# EAGLE design 4x7-segments Arduino shield (EAGLE 9.3.2)

## Sheet 1 of 3
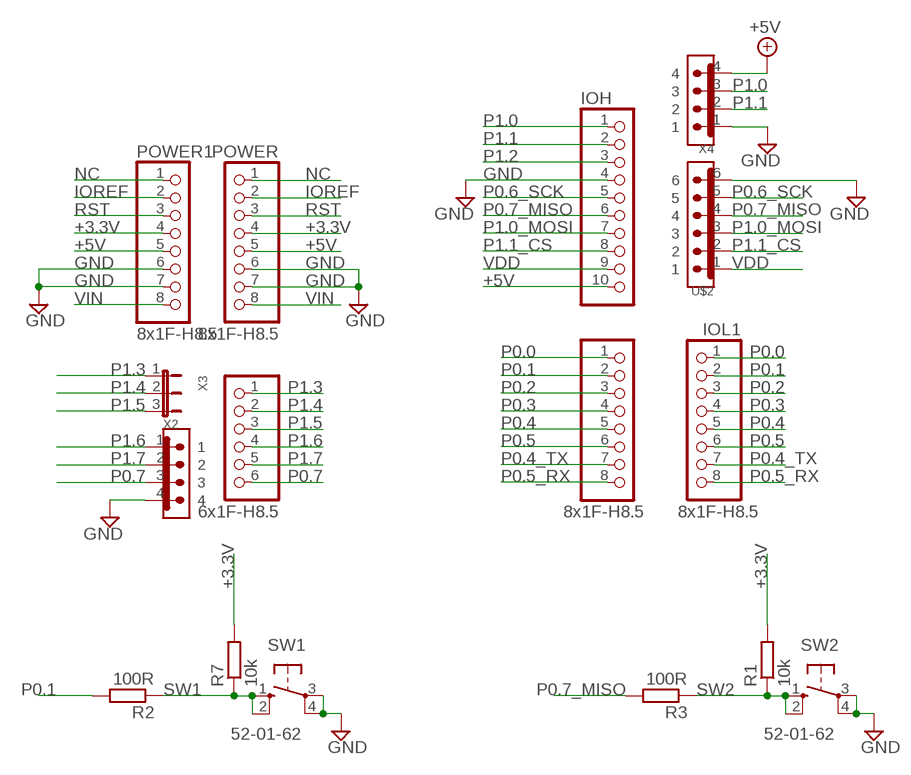
[diagram p0: schematic, sheet 1]

### Parts
AD  6x1F-H8.5  PINHD-1X6  [1X06]
IOH  10x1F-H8.5  PINHD-1X10_ARD  [1X10]
IOL  8x1F-H8.5  PINHD-1X8  [1X08]
IOL1  8x1F-H8.5  PINHD-1X8  [1X08]
POWER  8x1F-H8.5  PINHD-1X8  [1X08]
POWER1  8x1F-H8.5  PINHD-1X8  [1X08]
R1  10k  R0805  [R0805]
R2  100R  R0805  [R0805]
R3  100R  R0805  [R0805]
R7  10k  R0805  [R0805]
SW1  52-01-62  10-XX  [B3F-10XX]
SW2  52-01-62  10-XX  [B3F-10XX]
U$2  MOLEX6  [MOLEXV6]
X2  MOLEX4V  [MOLEXV4]
X3  JP2E  [JP2]
X4  MOLEX4V  [MOLEXV4]

### Nets
+3.3V: POWER1.4 POWER.4 R1.2 R7.2 ; also sheet 3
+5V: IOH.10 POWER1.5 POWER.5 X4.4 ; also sheet 2,3
GND: IOH.4 POWER1.6 POWER1.7 POWER.6 POWER.7 SW1.3(P) SW1.4(P1) SW2.3(P) SW2.4(P1) U$2.6 X2.4 X4.1 ; also sheet 2,3
IOREF: POWER1.2 POWER.2
NC: POWER1.1 POWER.1
P0.0: IOL1.1 IOL.1 ; also sheet 2
P0.1: IOL1.2 IOL.2 R2.2
P0.2: IOL1.3 IOL.3 ; also sheet 2
P0.3: IOL1.4 IOL.4 ; also sheet 2
P0.4: IOL1.5 IOL.5 ; also sheet 2
P0.4_TX: IOL1.7 IOL.7
P0.5: IOL1.6 IOL.6
P0.5_RX: IOL1.8 IOL.8
P0.6_SCK: IOH.5 U$2.5
P0.7: AD.6 X2.3
P0.7_MISO: IOH.6 R3.2 U$2.4
P1.0: IOH.1 X4.3
P1.0_MOSI: IOH.7 U$2.3
P1.1: IOH.2 X4.2 ; also sheet 2
P1.1_CS: IOH.8 U$2.2
P1.2: IOH.3 ; also sheet 2
P1.3: AD.1 X3.1
P1.4: AD.2 X3.2
P1.5: AD.3 X3.3 ; also sheet 3
P1.6: AD.4 X2.1
P1.7: AD.5 X2.2 ; also sheet 3
RST: POWER1.3 POWER.3
SW1: R2.1 R7.1 SW1.1(S) SW1.2(S1)
SW2: R1.1 R3.1 SW2.1(S) SW2.2(S1)
VDD: IOH.9 U$2.1
VIN: POWER1.8 POWER.8

## Sheet 2 of 3
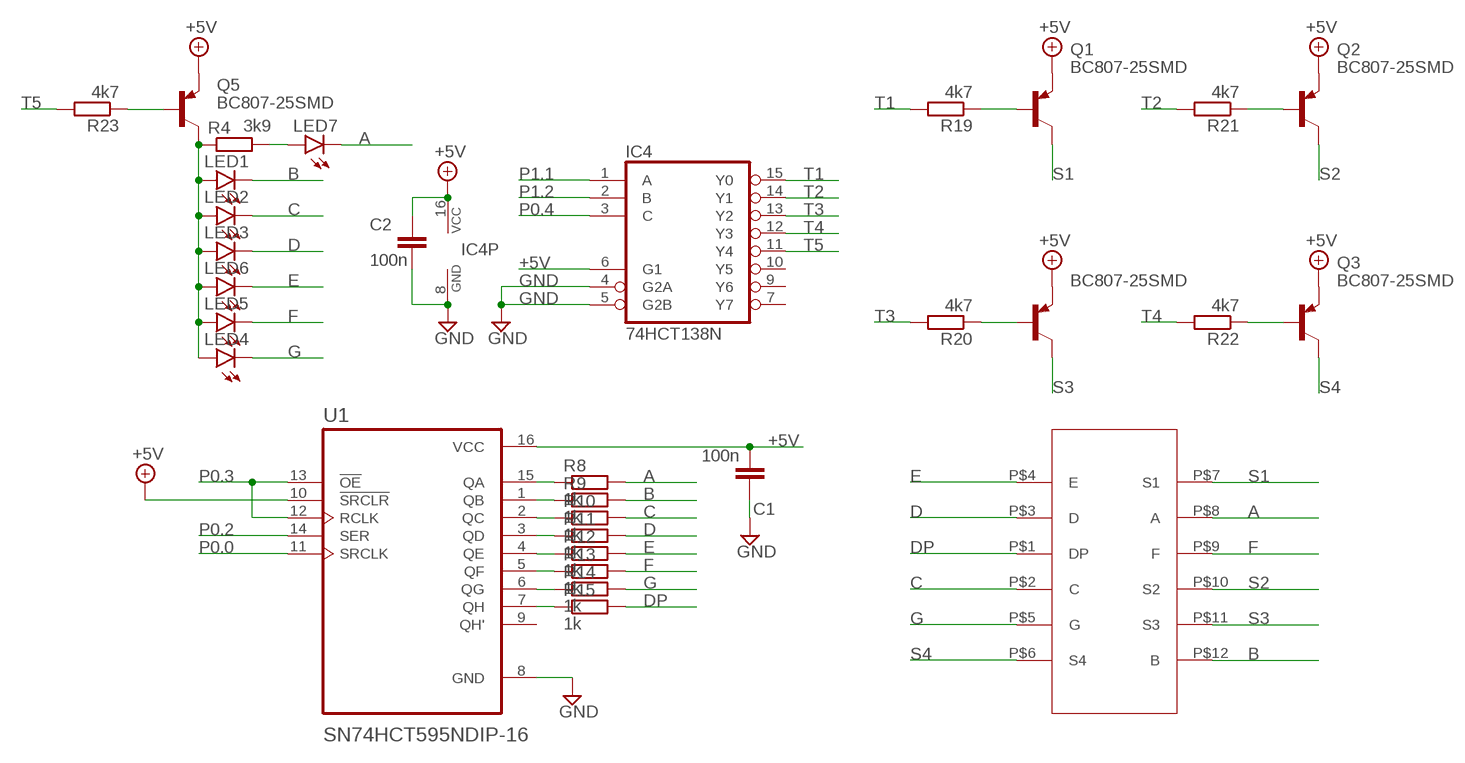
[diagram p1: schematic, sheet 2]

### Parts
C1  100n  C0805  [C0805]
C2  100n  C0805  [C0805]
IC4  74HCT138N  74HC138N  [DIL16]
LED1  LEDCHIPLED_1206  [CHIPLED_1206]
LED2  LEDCHIPLED_1206  [CHIPLED_1206]
LED3  LEDCHIPLED_1206  [CHIPLED_1206]
LED4  LEDCHIPLED_1206  [CHIPLED_1206]
LED5  LEDCHIPLED_1206  [CHIPLED_1206]
LED6  LEDCHIPLED_1206  [CHIPLED_1206]
LED7  LEDCHIPLED_1206  [CHIPLED_1206]
Q1  BC807-25SMD  [SOT23-BEC]
Q2  BC807-25SMD  [SOT23-BEC]
Q3  BC807-25SMD  [SOT23-BEC]
Q4  BC807-25SMD  [SOT23-BEC]
Q5  BC807-25SMD  [SOT23-BEC]
R4  3k9  R1206  [R1206]
R8  1k  R1206  [R1206]
R9  1k  R1206  [R1206]
R10  1k  R1206  [R1206]
R11  1k  R1206  [R1206]
R12  1k  R1206  [R1206]
R13  1k  R1206  [R1206]
R14  1k  R1206  [R1206]
R15  1k  R1206  [R1206]
R19  4k7  R0805  [R0805]
R20  4k7  R0805  [R0805]
R21  4k7  R0805  [R0805]
R22  4k7  R0805  [R0805]
R23  4k7  R0805  [R0805]
U1  SN74HCT595NDIP-16  SN74HC595NDIP-16  [DIP794W45P254L1969H508Q16]
U$1  SH5461AS  [SH5461AS]

### Nets
+5V: C1.1 C2.2 IC4.6(G1) IC4.16(VCC) Q1.E Q2.E Q3.E Q4.E Q5.E U1.10(!SRCLR) U1.16(VCC) ; also sheet 1,3
A: LED7.C R8.2 U$1.P$8(A)
B: LED1.C R9.2 U$1.P$12(B)
C: LED2.C R10.2 U$1.P$2(C)
D: LED3.C R11.2 U$1.P$3(D)
DP: R15.2 U$1.P$1(DP)
E: LED6.C R12.2 U$1.P$4(E)
F: LED5.C R13.2 U$1.P$9(F)
G: LED4.C R14.2 U$1.P$5(G)
GND: C1.2 C2.1 IC4.4(G2A) IC4.5(G2B) IC4.8(GND) U1.8(GND) ; also sheet 1,3
N$1: R8.1 U1.15(QA)
N$2: R9.1 U1.1(QB)
N$3: R10.1 U1.2(QC)
N$4: R11.1 U1.3(QD)
N$5: R12.1 U1.4(QE)
N$6: R13.1 U1.5(QF)
N$7: R14.1 U1.6(QG)
N$8: R15.1 U1.7(QH)
N$9: Q1.B R19.1
N$10: Q4.B R20.1
N$11: Q2.B R21.1
N$12: Q3.B R22.1
N$13: LED1.A LED2.A LED3.A LED4.A LED5.A LED6.A Q5.C R4.1
N$14: Q5.B R23.1
N$15: LED7.A R4.2
P0.0: U1.11(SRCLK) ; also sheet 1
P0.2: U1.14(SER) ; also sheet 1
P0.3: U1.12(RCLK) U1.13(!OE) ; also sheet 1
P0.4: IC4.3(C) ; also sheet 1
P1.1: IC4.1(A) ; also sheet 1
P1.2: IC4.2(B) ; also sheet 1
S1: Q1.C U$1.P$7(S1)
S2: Q2.C U$1.P$10(S2)
S3: Q4.C U$1.P$11(S3)
S4: Q3.C U$1.P$6(S4)
T1: IC4.15(Y0) R19.2
T2: IC4.14(Y1) R21.2
T3: IC4.13(Y2) R20.2
T4: IC4.12(Y3) R22.2
T5: IC4.11(Y4) R23.2
Unconnected: IC4.7(Y7) IC4.9(Y6) IC4.10(Y5) U1.9(QH')

## Sheet 3 of 3
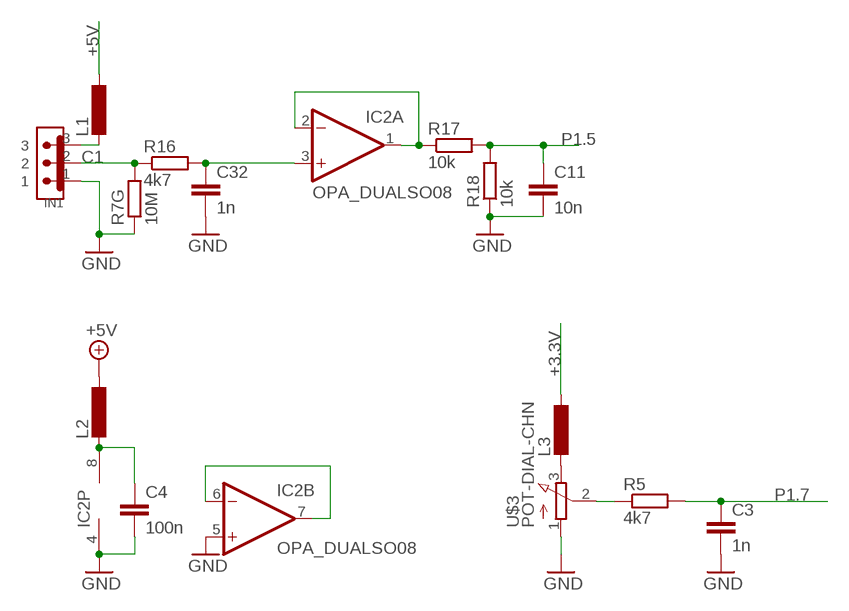
[diagram p2: schematic, sheet 3]

### Parts
C3  1n  C0805  [C0805]
C4  100n  C0805  [C0805]
C11  10n  C0805  [C0805]
C32  1n  C0805  [C0805]
IC2  OPA_DUALSO08  [SO08]
IN1  MOLEX3V  [MOLEXV3]
L1  L0805  [R0805]
L2  L0805  [R0805]
L3  L0805  [R0805]
R5  4k7  R0805  [R0805]
R7G  10M  R0805  [R0805]
R16  4k7  R0805  [R0805]
R17  10k  R1206  [R1206]
R18  10k  R1206  [R1206]
U$3  POT-DIAL-CHN  [POT5]

### Nets
+3.3V: L3.2 ; also sheet 1
+5V: L1.2 L2.2 ; also sheet 1,2
C1: IN1.2 R7G.2 R16.1
GND: C3.1 C4.1 C11.1 C32.1 IC2.4(P:V-) IC2.5(B:+IN) IN1.1 R7G.1 R18.1 U$3.1(A) ; also sheet 1,2
N$16: L3.1 U$3.3(E)
N$17: R5.1 U$3.2(S)
N$23: C32.2 IC2.3(A:+IN) R16.2
N$24: IN1.3 L1.1
N$25: C4.2 IC2.8(P:V+) L2.1
N$26: IC2.6(B:-IN) IC2.7(B:OUT)
N$32: IC2.1(A:OUT) IC2.2(A:-IN) R17.1
P1.5: C11.2 R17.2 R18.2 ; also sheet 1
P1.7: C3.2 R5.2 ; also sheet 1

## Library data of the parts
AD = SmartPrj:PINHD-1X6: PIN HEADER
C1-C3 C32 = Zoli:C: Capacitor
C4 = Zoli2:C: Capacitor
C11 = NoiseRLC:C: Capacitor
IC2 = NoiseIC:OPA_DUAL: Dual OP-Amp
IC4 = 74xx-eu:74*138: 3-line to 8-line DECODER/DEMULTIPLEXER
IN1 = NoiseEM:MOLEX3: 3 pin molex connector
IOH = SmartPrj:PINHD-1X10_ARD: PIN HEADER
IOL IOL1 POWER POWER1 = SmartPrj:PINHD-1X8: PIN HEADER
L1-L3 = Zoli2:L: Inductance
LED1-LED7 = led:LED: LED OSRAM: - CHIPLED LG R971, LG N971, LY N971, LG Q971, LY Q971, LO R971, LY R971 LH N974, LH R974 LS Q976, LO Q976, LY Q976 LO Q996 - Hyper CHIPLED LW Q18S LB Q993, LB Q99A, LB R99A - SideLED LS A670, LO A670, LY A670, LG A670, LP A670 LB A673, LV A673, LT A673, LW A673 LH A674 LY A675 LS A676, LA A676, LO A676, LY A676, LW A676 LS A679, LY A679, LG A679 - Hyper Micro SIDELED® LS Y876, LA Y876, LO Y876, LY Y876 LT Y87S - SmartLED LW L88C, LW L88S LB L89C, LB L89S, LG L890 LS L89K, LO L89K, LY L89K LS L896, LA L896, LO L896, LY L896 - TOPLED LS T670, LO T670, LY T670, LG T670, LP T670 LSG T670, LSP T670, LSY T670, LOP T670, LYG T670 LG T671, LOG T671, LSG T671 LB T673, LV T673, LT T673, LW T673 LH T674 LS T676, LA T676, LO T676, LY T676, LB T676, LH T676, LSB T676, LW T676 LB T67C, LV T67C, LT T67C, LS T67K, LO T67K, LY T67K, LW E67C LS E67B, LA E67B, LO E67B, LY E67B, LB E67C, LV E67C, LT E67C LW T67C LS T679, LY T679, LG T679 LS T770, LO T770, LY T770, LG T770, LP T770 LB T773, LV T773, LT T773, LW T773 LH T774 LS E675, LA E675, LY E675, LS T675 LS T776, LA T776, LO T776, LY T776, LB T776 LHGB T686 LT T68C, LB T68C - Hyper Mini TOPLED® LB M676 - Mini TOPLED Santana® LG M470 LS M47K, LO M47K, LY M47K Source: http://www.osram.convergy.de LUXEON: - LUMILED® LXK2-PW12-R00, LXK2-PW12-S00, LXK2-PW14-U00, LXK2-PW14-V00 LXK2-PM12-R00, LXK2-PM12-S00, LXK2-PM14-U00 LXK2-PE12-Q00, LXK2-PE12-R00, LXK2-PE12-S00, LXK2-PE14-T00, LXK2-PE14-U00 LXK2-PB12-K00, LXK2-PB12-L00, LXK2-PB12-M00, LXK2-PB14-N00, LXK2-PB14-P00, LXK2-PB14-Q00 LXK2-PR12-L00, LXK2-PR12-M00, LXK2-PR14-Q00, LXK2-PR14-R00 LXK2-PD12-Q00, LXK2-PD12-R00, LXK2-PD12-S00 LXK2-PH12-R00, LXK2-PH12-S00 LXK2-PL12-P00, LXK2-PL12-Q00, LXK2-PL12-R00 Source: www.luxeon.com KINGBRIGHT: KA-3528ASYC Source: www.kingbright.com
Q1-Q5 = transistor-pnp:BC807*: PNP Transistror
R1 R7 R17 R18 = Zoli2:R: Resistor
R2-R5 R7G R8-R16 R19-R23 = NoiseRLC:R: Resistor
SW1 SW2 = switch-omron:10-XX: OMRON SWITCH; MPN: B3F-1000; OC_FARNELL: 176432; OC_NEWARK: 36M3542
U1 = SN74HC595N:SN74HC595N: Check prices <https://pricing.snapeda.com/parts/SN74HC595N/Texas%20Instruments/view-part?ref=eda>; AVAILABILITY: In Stock; DESCRIPTION: 8-bit shift registers with 3-state output registers 16-PDIP -40 to 85; MF: Texas Instruments; MP: SN74HC595N; PACKAGE: PDIP-16 Texas Instruments; PRICE: None; PURCHASE-URL: https://pricing.snapeda.com/search/part/SN74HC595N/?ref=eda
U$1 = EAT:SH5461AS
U$2 = NoiseEM:MOLEX6
U$3 = Gergo:POT-DIAL-CHN
X2 X4 = NoiseEM:MOLEX4: 4 pin molex connector
X3 = EAT:JP2E: JUMPER

## Board
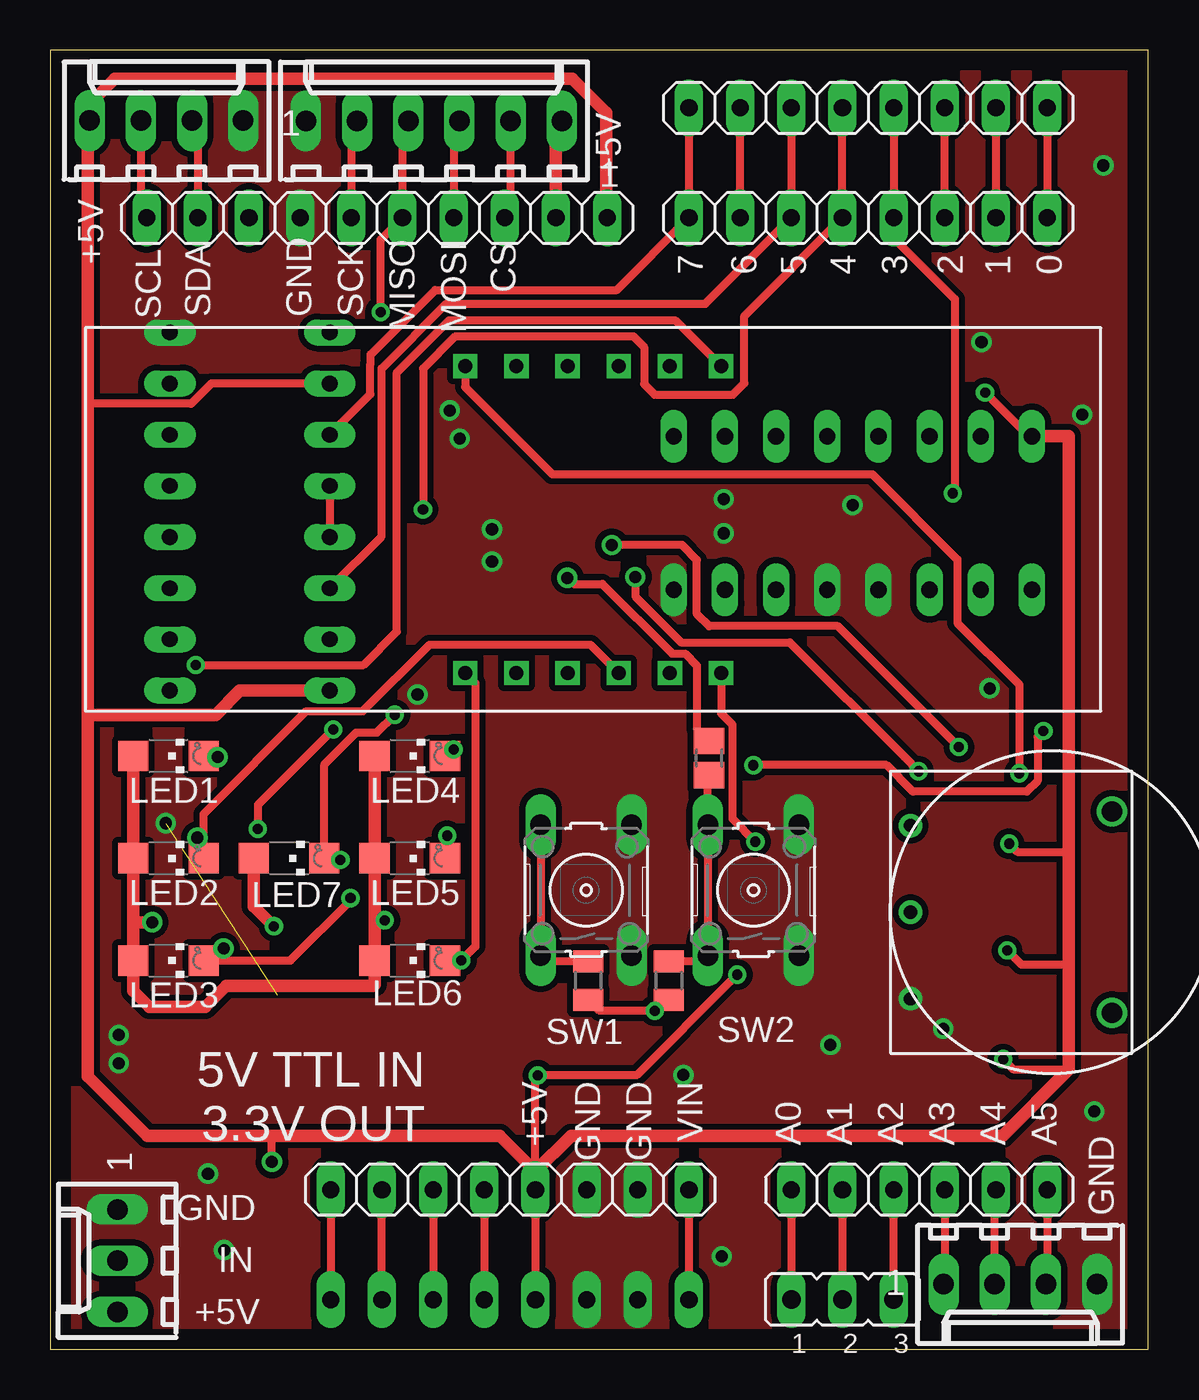
[diagram p3: board, top side]
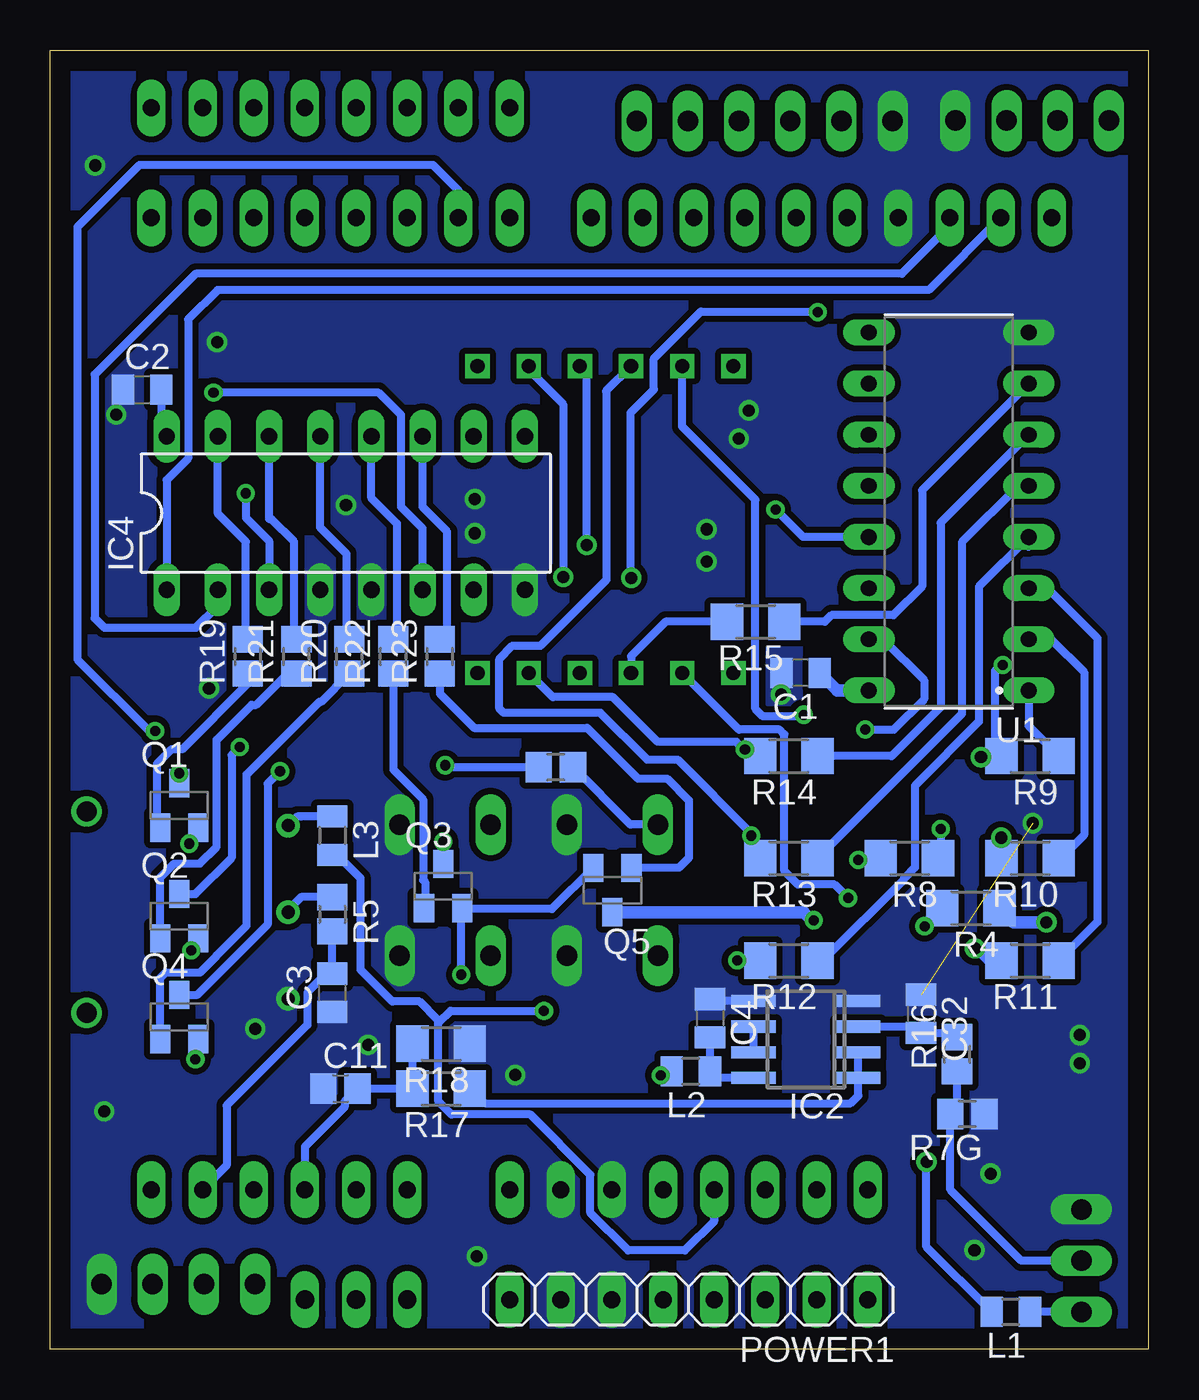
[diagram p4: board, bottom side, seen from below]

Size 54.5 x 64.5 mm. Coordinates in mm from the lower left corner, seen from the top.
Outline: 0,0 54.5,0 54.5,64.5 0,64.5 0,0
Copper layers (1*16): Top 0.035mm / dielectric 1.5mm / Bottom 0.035mm
Design rules "mikropan": minimum track width 10mil, minimum drill 0.5mm, track to track 6mil, track to pad 6mil, pad to pad 6mil, via to via 10mil, smd to smd 0mil, copper to edge 40mil, drill to drill 16mil, minimum pad ring 10mil, minimum via ring 8mil, stop-mask expansion 4mil, vias tented up to drill 0mil, thermal gap 10mil

### Footprints (pad centres in the part's own frame; a part is rotated, then mirrored left to right if it is on the bottom)
1X06 = drill 0.85 pad 1.422 long: 1 -6.35,0; 2 -3.81,0; 3 -1.27,0; 4 1.27,0; 5 3.81,0; 6 6.35,0
C0805 = smd 1.1 x 1.5: 1 -0.95,0; 2 0.95,0
C0805' = smd 1.3 x 1.5: 1 -0.85,0; 2 0.85,0
SO08 = smd 0.6 x 2.2: 1 -1.905,-2.6; 2 -0.635,-2.6; 3 0.635,-2.6; 4 1.905,-2.6; 5 1.905,2.6; 6 0.635,2.6; 7 -0.635,2.6; 8 -1.905,2.6
DIL16 = drill 0.813 long: 1 -8.89,-3.81; 2 -6.35,-3.81; 3 -3.81,-3.81; 4 -1.27,-3.81; 5 1.27,-3.81; 6 3.81,-3.81; 7 6.35,-3.81; 8 8.89,-3.81; 9 8.89,3.81; 10 6.35,3.81; 11 3.81,3.81; 12 1.27,3.81; 13 -1.27,3.81; 14 -3.81,3.81; 15 -6.35,3.81; 16 -8.89,3.81
MOLEXV3 = drill 1.016 long: 1 2.54,0; 2 0,0; 3 -2.54,0
1X10 = drill 0.85 pad 1.422 long: 1 -11.43,0; 2 -8.89,0; 3 -6.35,0; 4 -3.81,0; 5 -1.27,0; 6 1.27,0; 7 3.81,0; 8 6.35,0; 9 8.89,0; 10 11.43,0
1X08 = drill 0.85 pad 1.422 long: 1 -8.89,0; 2 -6.35,0; 3 -3.81,0; 4 -1.27,0; 5 1.27,0; 6 3.81,0; 7 6.35,0; 8 8.89,0
R0805 = smd 1.1 x 1.5: 1 -0.95,0; 2 0.95,0
CHIPLED_1206 = smd 1.5 x 1.5: A 0,-1.75; C 0,1.75
SOT23-BEC = smd 1 x 1.4: B -0.95,-1.1; C 0,1.1; E 0.95,-1.1
R0805' = smd 1.3 x 1.5: 1 -0.85,0; 2 0.85,0
R1206 = smd 1.6 x 1.803: 1 -1.422,0; 2 1.422,0
B3F-10XX = drill 1.016 long: 1 -3.251,2.261; 2 3.251,2.261; 3 -3.251,-2.261; 4 3.251,-2.261
DIP794W45P254L1969H508Q16 = drill 0.78 pad 1.13 long: 1 -3.97,8.89; 2 -3.97,6.35; 3 -3.97,3.81; 4 -3.97,1.27; 5 -3.97,-1.27; 6 -3.97,-3.81; 7 -3.97,-6.35; 8 -3.97,-8.89; 9 3.97,-8.89; 10 3.97,-6.35; 11 3.97,-3.81; 12 3.97,-1.27; 13 3.97,1.27; 14 3.97,3.81; 15 3.97,6.35; 16 3.97,8.89
SH5461AS = drill 0.7 square: P$1 -0.19,-6.99; P$2 2.35,-6.99; P$3 -2.73,-6.99; P$4 -5.27,-6.99; P$5 4.89,-6.99; P$6 7.43,-6.99; P$7 -5.27,8.25; P$8 -2.73,8.25; P$9 -0.19,8.25; P$10 2.35,8.25; P$11 4.89,8.25; P$12 7.43,8.25
MOLEXV6 = drill 1.016 long: 1 8.89,0; 2 6.35,0; 3 3.81,0; 4 1.27,0; 5 -1.27,0; 6 -3.81,0
POT5 = drill 0.65: 1 -4.3,3; 2 0,3; 3 4.3,3 | drill 1: P$4 5,-7; P$5 -5,-7
MOLEXV4 = drill 1.016 long: 1 3.81,0; 2 1.27,0; 3 -1.27,0; 4 -3.81,0
JP2 = drill 0.914 long: 1 -2.54,0; 2 0,0; 3 2.54,0

### Placement (x,y rotation side)
AD  43.13,7.92 0 top
C1  17.26,33.59 180 bottom
C2  49.95,47.65 0 bottom
C3  40.5,17.7 90 bottom
C4  21.75,16.44 270 bottom
C11  10n  [C0805']  40.1,12.94 0 bottom
C32  11.27,16.65 270 bottom
IC2  16.99,15.38 90 bottom
IC4  39.83,41.52 0 bottom
IN1  3.32,4.39 90 top
IOH  16.21,56.18 0 top
IOL  40.59,56.18 0 top
IOL1  40.59,61.64 0 top
L1  6.81,1.85 180 bottom
L2  22.71,13.79 180 bottom
L3  40.5,25.5 270 bottom
LED1  5.86,29.46 270 top
LED2  5.86,24.38 270 top
LED3  5.86,19.3 270 top
LED4  17.84,29.46 270 top
LED5  17.84,24.38 270 top
LED6  17.84,19.3 270 top
LED7  11.85,24.38 270 top
POWER  22.81,7.92 0 top
POWER1  22.81,2.46 180 bottom
Q1  48.1,27 0 bottom
Q2  48.1,21.5 0 bottom
Q3  35,23 0 bottom
Q4  48.1,16.5 0 bottom
Q5  26.6,22.8 180 bottom
R1  30.7,18.3 270 top
R2  100R  [R0805']  29.4,28.9 180 bottom
R3  100R  [R0805']  32.7,29.35 90 top
R4  8.8,21.9 180 bottom
R5  4k7  [R0805']  40.5,21.6 270 bottom
R7  26.7,18.3 270 top
R7G  10M  [R0805']  8.97,11.68 180 bottom
R8  11.85,24.38 180 bottom
R9  5.86,29.46 180 bottom
R10  5.86,24.38 180 bottom
R11  5.86,19.3 180 bottom
R12  17.84,19.3 180 bottom
R13  17.84,24.38 180 bottom
R14  17.84,29.46 180 bottom
R15  19.49,36.12 180 bottom
R16  4k7  [R0805']  9.49,14.65 90 bottom
R17  35.1,12.94 180 bottom
R18  35.1,15.17 180 bottom
R19  4k7  [R0805']  44.7,34.4 90 bottom
R20  4k7  [R0805']  39.66,34.4 90 bottom
R21  4k7  [R0805']  42.28,34.4 90 bottom
R22  4k7  [R0805']  37.48,34.4 90 bottom
R23  4k7  [R0805']  35.16,34.4 90 bottom
SW1  26.6,22.8 90 top
SW2  34.9,22.8 90 top
U1  9.9,41.6 180 bottom
U$1  25.86,40.57 0 top
U$2  16.5,61 0 top
U$3  45.7,21.7 90 top
X2  48.15,3.22 180 top
X3  39.32,2.46 0 top
X4  5.76,61.01 0 top

### Tracks (layer width: path | path; a pad name or v marks a point on that pad's centre or on a via)
+3.3V  (via drill 0.5)
  Top 0.406: POWER.4 POWER1.4 | R7.2 27.25,16.8 v30,16.8 30.15,16.8 R1.2
  Bottom 0.406: 35.23,16.2 35.23,12.29 34.59,11.65 30.67,11.65 27.69,8.67 27.69,6.77 25.82,4.9 23,4.9 21.54,6.36 POWER.4 21.54,6.34 | 35.23,16.2 35.23,16.33 36.17,17.27 37.52,17.27 39.09,18.84 39.09,23.38 40.26,24.55 L3.2 | 35.23,16.2 34.63,16.8 v30,16.8
+5V  (via drill 0.5, 0.6)
  Top 0.406: v47.6,25.1 48,24.7 50.57,24.7 | v47.5,19.8 48.2,19.1 50.57,19.1 | v47.3,14.4 47.8,13.9 50.57,13.9 | POWER1.5 POWER.5 24.08,13.48 v24.2,13.6 29.11,13.6 33.81,18.3 33.81,18.31 v34.1,18.6 | v46.4,47.5 48.57,45.33 IC4.16 | U1.10 7.99,47.95 6.99,46.95 1.9,46.95 1.85,46.9 | v11,9.3 11,10.5 11.1,10.6
  Top 0.61: 24.08,8.82 25.86,10.6 47.27,10.6 50.57,13.9 50.57,19.1 50.57,24.7 50.57,45.33 IC4.16 | POWER.5 24.08,8.82 | 24.08,8.82 22.3,10.6 11.1,10.6 4.8,10.6 1.85,13.55 1.85,31.5 | 1.85,31.5 1.85,46.9 1.85,60.91 X4.4 1.95,61.85 3.2,63.1 25.9,63.1 27.6,61.4 27.6,56.22 IOH.10 | U1.16 9.41,32.71 8.2,31.5 1.85,31.5
  Bottom 0.406: C2.2 49,45.61 IC4.16 | Q1.E 47.3,25.75 47.3,25.4 v47.6,25.1 | Q2.E 47.5,20.05 v47.5,19.8 | Q4.E 47.15,14.65 47.3,14.5 v47.3,14.4 | L2.2 24,13.79 v24.2,13.6 | v34.1,18.6 34.1,21.85 | 34.1,21.85 Q3.E | Q5.E 29.6,21.85 34.1,21.85 | IC4.6 36.03,40.76 37.09,41.83 37.09,46.39 38.2,47.5 v46.4,47.5 | L1.2 11.01,5.09 | 11.01,5.09 11.01,5.1 | 11.01,5.09 11.01,9.19 11,9.2 v11,9.3
  Bottom 0.61: C1.1 15.43,32.71 U1.16
A  (via drill 0.5)
  Top 0.406: v14.4,24.3 13.4,24.18 LED7.C 13.6,29.04 15.17,30.61 16.21,30.61 v17.1,31.5
  Bottom 0.406: R8.2 13.4,24.25 v14.4,24.3 | v17.1,31.5 17.17,31.43 19.13,31.43 19.5,31.8 19.5,42.19 23.14,45.82 U$1.P$8
B  (via drill 0.5, 0.6)
  Top 0.406: v8.3,29.4 7.61,29.4 LED1.C 8.51,29.46 | v7.21,33.98 15.55,33.98 17.2,35.63 17.2,48.5 19.8,51.1 31.01,51.1 U$1.P$12
  Bottom 0.406: R9.2 8.4,29.46 8.4,29.4 v8.3,29.4 7.6,30.1 7.6,33.7 7.3,34 7,34 7.02,33.98 v7.21,33.98
C  (via drill 0.6)
  Top 0.406: v7.3,25.4 7.4,25.4 7.4,24.59 LED2.C 7.61,26.58 12.71,31.68 15.51,31.68 18.81,34.98 26.82,34.98 U$1.P$2
  Bottom 0.406: R10.2 7.28,25.39 v7.3,25.4
C1
  Bottom 0.406: R16.1 9.49,12.01 R7G.2 9.82,7.92 6.29,4.39 IN1.2
D  (via drill 0.5, 0.6)
  Top 0.406: v8.6,19.9 8.21,19.9 LED3.C 11.91,19.3 14.9,22.29 v14.9,22.4
  Bottom 0.406: v8.6,19.9 8,19.3 R11.2 | U$1.P$3 20.32,30.77 18.3,30.77 18.06,30.53 18.06,23.74 17.39,23.07 15.57,23.07 v14.9,22.4
DP
  Bottom 0.406: R15.2 23.96,36.12 25.68,34.41 U$1.P$1
E  (via drill 0.5)
  Top 0.406: U$1.P$4 21.1,33.08 21.1,20 v20.4,19.3 LED6.C
  Bottom 0.406: R12.2 20.3,19.3 v20.4,19.3
F  (via drill 0.5)
  Top 0.406: v19.7,25.5 19.59,25.39 LED5.C
  Bottom 0.406: U$1.P$9 26.92,47.57 26.9,47.52 26.9,38.2 30.16,34.94 31.56,34.94 32.22,34.29 32.22,31.82 32,31.6 27.2,31.6 24.88,29.28 23.36,29.28 19.7,25.61 v19.7,25.5 19.7,24.81 R13.2
G  (via drill 0.5)
  Top 0.406: LED4.C 19.92,29.78 v20.02,29.78
  Bottom 0.406: U$1.P$5 29.55,32.38 26.57,32.38 24.35,30.16 20.45,30.16 20.07,29.78 v20.02,29.78 19.69,29.46 R14.2
GND  (via drill 0.6)  (1 unrouted)
  Bottom 0.406: IC2.5 21.65,17.29 C4.1 | C2.1 51.22,47.32 v51.22,46.41
  other vias: 52.28,58.79 46.62,32.82 5.73,26.12 3.4,14.2 33.42,40.52 33.42,42.22 38.72,15.12 31.43,13.62 21.93,39.12 46.22,50.02 18.22,32.52 20.32,45.22 39.83,41.91 8.62,4.92 7.82,8.71 3.4,15.6 51.83,11.81 44.33,15.92 19.82,46.62 21.93,40.72 33.33,4.62
  pour Top (isolate 0.305, no thermals): 0,0.05 54.5,0.05 54.5,64.5 0,64.5
  pour Bottom (isolate 0.305, no thermals): 0,0.05 54.5,0.05 54.5,64.5 0,64.5
IOREF
  Top 0.406: POWER1.2 POWER.2
N$1  (via drill 0.5)
  Top 0.406: v14.04,30.77 10.3,27.03 v10.3,25.84 10.3,25.6
  Bottom 0.406: U1.15 13.15,35.25 11.13,33.22 11.13,32.27 12.63,30.77 v14.04,30.77 | v10.3,25.84 10.3,24.51 R8.1
N$2
  Bottom 0.406: U1.1 5.93,30.95 R9.1
N$3
  Bottom 0.406: U1.2 4.81,35.25 3.18,33.62 3.18,25.53 4.34,24.38 R10.1
N$4
  Bottom 0.406: U1.3 5.01,37.79 2.53,35.3 2.53,21.21 R11.1
N$5
  Bottom 0.406: 5.93,39.85 U1.4 8.4,37.86 8.4,31.16 11.59,27.97 11.59,23.91 12.12,23.38 12.12,23.33 16.15,19.3 R12.1
N$6
  Bottom 0.406: R13.1 9.25,31.55 9.25,40.07 6.45,42.87 U1.5
N$7
  Bottom 0.406: U1.6 10.3,41.04 10.3,31.9 12.74,29.46 R14.1
N$8
  Bottom 0.406: U1.7 11.23,42.65 11.23,37.88 12.65,36.45 15.73,36.45 16.05,36.12 R15.1 18.07,36.65
N$9
  Bottom 0.406: Q1.B 49.21,26.06 49.21,29.07 48.49,29.79 47.96,29.79 44.7,33.05 R19.1
N$10
  Bottom 0.406: R20.1 41.06,32.15 41.15,32.15 44.76,28.54 44.76,21.04 46.24,19.56 46.24,19.53 47.07,18.71 48.77,18.71 49.05,18.43 Q4.B
N$11
  Bottom 0.406: Q2.B 49.05,23.43 48.36,24.12 47.08,24.12 46.24,24.95 46.24,30.26 44.51,31.99 44.28,31.99 42.72,33.55 R21.1
N$12
  Bottom 0.406: R22.1 37.48,28.78 35.99,27.3 35.99,23.29 35.9,23.2 35.9,21.95 Q3.B
N$13  (via drill 0.5, 0.6)
  Top 0.61: LED1.A LED2.A 4.11,21.2 | 4.11,21.2 LED3.A 4.11,17.79 4.9,17 7.7,17 8.73,18.03 16,18.03 16.09,18.12 LED6.A 16.09,21.3 | LED4.A LED5.A 16.09,21.3 | 4.11,21.2 v5.05,21.2 | v16.6,21.3 16.09,21.3
  Bottom 0.61: R4.1 6.68,21.2 v5.05,21.2 | Q5.C 17.1,21.7 16.65,21.25 v16.6,21.3
N$14
  Bottom 0.406: R23.1 35.16,32.55 33.46,30.85 27.85,30.85 25.33,28.33 23.88,28.33 22.8,27.25 22.8,24.4 23.3,23.9 Q5.B
N$15  (via drill 0.5)
  Top 0.61: v11.1,21 10.1,22 LED7.A
  Bottom 0.61: R4.2 11.1,21.02 v11.1,21
N$16
  Bottom 0.406: L3.1 42.05,26.45 42.25,26.45 U$3.3
N$17
  Bottom 0.406: R5.1 42.05,22.45 42.7,21.8 U$3.2
N$23
  Bottom 0.406: IC2.3 11.59,16.02 C32.2 9.69,15.7 R16.2
N$24
  Bottom 0.406: IN1.3 L1.1
N$25
  Bottom 0.406: IC2.8 21.44,13.48 L2.1 C4.2
N$26
  Bottom 0.406: IC2.7 IC2.6
N$32
  Bottom 0.406: IC2.2 IC2.1 14.39,12.58 14.77,12.21 32.94,12.21 R17.1
NC
  Top 0.406: POWER.1 POWER1.1
P0.0
  Top 0.406: IOL1.1 IOL.1 28.12,52.6 19.1,52.6 15.9,49.4 15.9,48.95 15.88,48.94 15.88,47.42 U1.11
P0.1  (via drill 0.5)
  Top 0.406: IOL.2 IOL1.2 | v49.3,30.7 49.01,30.41 49.01,28.22 48.48,27.69 42.82,27.69 41.51,29 v34.9,29
  Bottom 0.406: IOL.2 34.24,57.54 35.5,58.8 50.08,58.8 53.16,55.72 53.16,34.26 49.6,30.7 v49.3,30.7 | v34.9,29 34.8,28.9 R2.2
P0.2
  Top 0.406: IOL1.3 IOL.3 32.51,51.91 19.65,51.91 16.44,48.7 16.44,40.36 U1.14
P0.3  (via drill 0.5)
  Top 0.406: IOL1.4 IOL.4 34.45,51.31 34.45,47.97 33.89,47.4 30,47.4 29.47,47.93 29.47,49.77 28.95,50.3 20.1,50.3 18.5,48.7 v18.5,41.7 | U1.12 13.87,41.4 U1.13
  Bottom 0.406: U1.13 17.13,40.33 v18.5,41.7
P0.4  (via drill 0.5)
  Top 0.406: IOL1.5 IOL.5 41.86,55.18 44.9,52.15 44.9,42.5 v44.8,42.5
  Bottom 0.406: v44.8,42.5 44.8,41.29 43.64,40.13 IC4.3
P0.4_TX
  Top 0.406: IOL1.7 IOL.7
P0.5
  Top 0.406: IOL.6 IOL1.6
P0.5_RX
  Top 0.406: IOL1.8 IOL.8
P0.6_SCK
  Top 0.406: 14.94,60.71 U$2.5 14.94,60.71 IOH.5 14.8,56.04
P0.7
  Top 0.406: AD.6 49.48,3.29 X2.3
P0.7_MISO  (via drill 0.5, 0.6)
  Top 0.406: R3.2 32.1,30.8 32.1,33.95 31.51,34.54 30.86,34.54 27.4,38 25.96,38 v25.67,38.3 | U$2.4 17.48,60.71 IOH.6 16.4,55.1 v16.4,51.5
  Bottom 0.406: v25.67,38.3 25.7,38.34 25.7,46.5 24.54,47.66 24.54,49.19 22.21,51.53 16.43,51.53 v16.4,51.5
P1.0
  Top 0.406: X4.3 4.49,56.47 IOH.1
P1.0_MOSI
  Top 0.406: U$2.3 20.02,60.71 IOH.7
P1.1
  Top 0.406: X4.2 7.32,60.72 IOH.2
  Bottom 0.406: IOH.2 10.9,52.6 46.2,52.6 47.66,51.14 47.66,44.23 48.72,43.16 IC4.1
P1.1_CS
  Top 0.406: U$2.2 22.85,56.47 IOH.8
P1.2
  Top 0.406: 46.19,36.61 IC4.2
  Bottom 0.406: IOH.3 9.86,55.78 12.23,53.41 47.29,53.41 52.3,48.4 52.3,36.3 51.83,35.83 47.28,35.83 46.19,36.91 IC4.2
P1.3
  Top 0.406: AD.1 X3.1
P1.4
  Top 0.406: AD.2 X3.2
P1.5
  Top 0.406: X3.3 AD.3
  Bottom 0.406: R18.2 R17.2 C11.2 39.89,12.3 39.89,12.02 41.86,10.05 AD.3
P1.6
  Top 0.406: AD.4 44.4,3.29 X2.1
P1.7
  Top 0.406: X2.2 46.88,7.86 AD.5
  Bottom 0.406: R5.2 C3.2 40.8,18.65 41.74,17.71 41.74,16.1 45.74,12.1 45.74,9.12 AD.5
RST
  Top 0.406: POWER.3 POWER1.3
S1  (via drill 0.5)
  Top 0.406: U$1.P$7 20.59,47.78 24.93,43.45 40.8,43.45 45.03,39.22 45.03,36.07 48.1,33 v48.1,28.6
  Bottom 0.406: v48.1,28.6 Q1.C
S2  (via drill 0.5, 0.6)
  Top 0.406: v27.87,39.94 31.36,39.94 32.1,39.2 32.1,36.5 32.7,35.9 39.1,35.9 v45.1,29.9
  Bottom 0.406: v27.87,39.94 27.9,39.96 27.9,48.43 28.21,48.76 U$1.P$10 | Q2.C 47.3,22.6 45.5,24.4 45.5,29.5 v45.1,29.9
S3  (via drill 0.5, 0.6)
  Top 0.406: v29.04,38.35 29.04,37.38 31.32,35.1 36.71,35.1 42.41,29.4 v43.1,28.7
  Bottom 0.406: U$1.P$11 30.75,48.63 29.04,46.92 v29.04,38.35 | Q4.C 47.2,17.6 43.71,21.09 43.71,28.09 v43.1,28.7
S4  (via drill 0.5)
  Top 0.406: U$1.P$6 33.3,31.58 33.86,31.02 33.86,26.34 v35,25.2
  Bottom 0.406: v35,25.2 Q3.C
SW1
  Top 0.406: SW1.2 SW1.1 24.64,19.25 R7.1
  Bottom 0.406: SW1.2 25.7,26.05 R2.1
SW2
  Top 0.406: R1.1 32.34,19.25 SW2.1 SW2.2 32.64,28.1 R3.1
T1
  Bottom 0.406: IC4.15 46.19,41.48 44.8,40.1 44.8,34.99 R19.2
T2
  Bottom 0.406: R21.2 42.71,35.16 42.4,35.47 42.4,40.1 43.5,41.2 43.6,41.2 43.64,41.25 IC4.14
T3
  Bottom 0.406: R20.2 39.8,35.4 39.8,39.5 41.11,40.8 IC4.13
T4
  Bottom 0.406: IC4.12 38.56,42.27 37.3,41 37.3,35.54 R22.2
T5
  Bottom 0.406: R23.2 34.8,35.36 34.8,40.6 36.03,41.83 IC4.11
VDD
  Top 0.61: IOH.9 25.1,60.71 U$2.1
VIN
  Top 0.406: POWER.8 POWER1.8

### Text on the board
tNames: +5V | +5V | 7 | 6 | 5 | 4 | 3 | 2 | 1 | 0 | CS | SCL | SDA | GND | SCK | MISO | MOSI | 5V TTL IN / 3.3V OUT | +5V | GND | GND | VIN | A0 | A1 | A2 | A3 | A4 | A5 | GND | GND | IN | +5V